# Altium project Rovot v4.PrjPcb
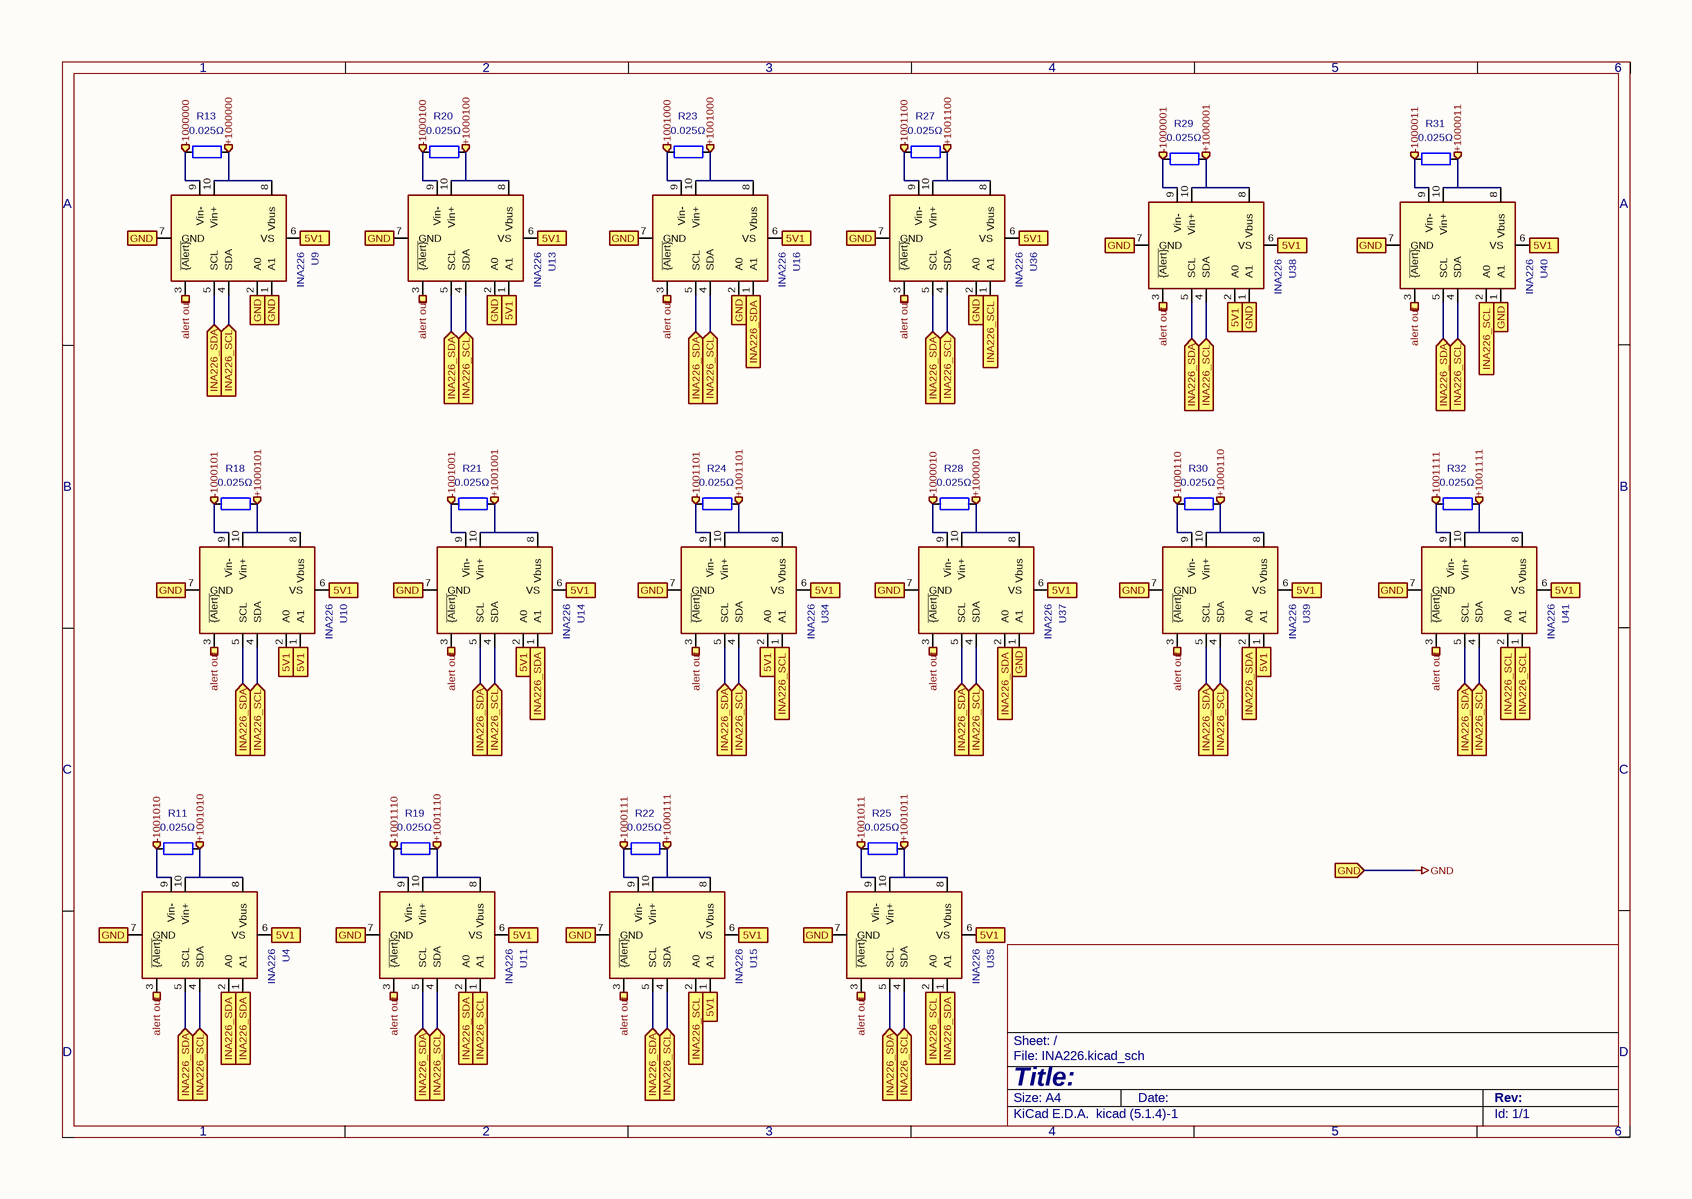
[diagram p0: INA226.SchDoc]
2 sheets, 32 parts. Net scope: flat (ports and power ports of the same name join across sheets).
Sheets:
  INA226.SchDoc
  root.SchDoc

## Sheet INA226.SchDoc
size 297 x 209 mm; SheetNumber: 2; SheetTotal: 2

### Parts
R11  0.025Ω  [R_1020_2550Metric]
R13  0.025Ω  [R_1020_2550Metric]
R18  0.025Ω  [R_1020_2550Metric]
R19  0.025Ω  [R_1020_2550Metric]
R20  0.025Ω  [R_1020_2550Metric]
R21  0.025Ω  [R_1020_2550Metric]
R22  0.025Ω  [R_1020_2550Metric]
R23  0.025Ω  [R_1020_2550Metric]
R24  0.025Ω  [R_1020_2550Metric]
R25  0.025Ω  [R_1020_2550Metric]
R27  0.025Ω  [R_1020_2550Metric]
R28  0.025Ω  [R_1020_2550Metric]
R29  0.025Ω  [R_1020_2550Metric]
R30  0.025Ω  [R_1020_2550Metric]
R31  0.025Ω  [R_1020_2550Metric]
R32  0.025Ω  [R_1020_2550Metric]
U4  INA226  [VSSOP-10_3x3mm_P0.5mm]
U9  INA226  [VSSOP-10_3x3mm_P0.5mm]
U10  INA226  [VSSOP-10_3x3mm_P0.5mm]
U11  INA226  [VSSOP-10_3x3mm_P0.5mm]
U13  INA226  [VSSOP-10_3x3mm_P0.5mm]
U14  INA226  [VSSOP-10_3x3mm_P0.5mm]
U15  INA226  [VSSOP-10_3x3mm_P0.5mm]
U16  INA226  [VSSOP-10_3x3mm_P0.5mm]
U34  INA226  [VSSOP-10_3x3mm_P0.5mm]
U35  INA226  [VSSOP-10_3x3mm_P0.5mm]
U36  INA226  [VSSOP-10_3x3mm_P0.5mm]
U37  INA226  [VSSOP-10_3x3mm_P0.5mm]
U38  INA226  [VSSOP-10_3x3mm_P0.5mm]
U39  INA226  [VSSOP-10_3x3mm_P0.5mm]
U40  INA226  [VSSOP-10_3x3mm_P0.5mm]
U41  INA226  [VSSOP-10_3x3mm_P0.5mm]

### Ports
5V1 (in), +1000000 (in), +1000001 (in), +1000010 (in), +1000011 (in), +1000100 (in), +1000101 (in), +1000110 (in), +1000111 (in), +1001000 (in), +1001001 (in), +1001010 (in), +1001011 (in), +1001100 (in), +1001101 (in), +1001110 (in), +1001111 (in), -1000000 (in), -1000001 (in), -1000010 (in), -1000011 (in), -1000100 (in), -1000101 (in), -1000110 (in), -1000111 (in), -1001000 (in), -1001001 (in), -1001010 (in), -1001011 (in), -1001100 (in), -1001101 (in), -1001110 (in), -1001111 (in), alert out (in), GND (in), INA226_SCL (in), INA226_SDA (in)

### Nets
GND: U4.7(GND) U9.1(A1) U9.2(A0) U9.7(GND) U10.7(GND) U11.7(GND) U13.2(A0) U13.7(GND) U14.7(GND) U15.7(GND) U16.2(A0) U16.7(GND) U34.7(GND) U35.7(GND) U36.2(A0) U36.7(GND) U37.1(A1) U37.7(GND) U38.1(A1) U38.7(GND) U39.7(GND) U40.1(A1) U40.7(GND) U41.7(GND) ; port GND
NetR11_1: R11.1 U4.8(Vbus) U4.10(Vin+) ; port +1001010
NetR11_2: R11.2 U4.9(Vin-) ; port -1001010
NetR13_1: R13.1 U9.8(Vbus) U9.10(Vin+) ; port +1000000
NetR13_2: R13.2 U9.9(Vin-) ; port -1000000
NetR18_1: R18.1 U10.8(Vbus) U10.10(Vin+) ; port +1000101
NetR18_2: R18.2 U10.9(Vin-) ; port -1000101
NetR19_1: R19.1 U11.8(Vbus) U11.10(Vin+) ; port +1001110
NetR19_2: R19.2 U11.9(Vin-) ; port -1001110
NetR20_1: R20.1 U13.8(Vbus) U13.10(Vin+) ; port +1000100
NetR20_2: R20.2 U13.9(Vin-) ; port -1000100
NetR21_1: R21.1 U14.8(Vbus) U14.10(Vin+) ; port +1001001
NetR21_2: R21.2 U14.9(Vin-) ; port -1001001
NetR22_1: R22.1 U15.8(Vbus) U15.10(Vin+) ; port +1000111
NetR22_2: R22.2 U15.9(Vin-) ; port -1000111
NetR23_1: R23.1 U16.8(Vbus) U16.10(Vin+) ; port +1001000
NetR23_2: R23.2 U16.9(Vin-) ; port -1001000
NetR24_1: R24.1 U34.8(Vbus) U34.10(Vin+) ; port +1001101
NetR24_2: R24.2 U34.9(Vin-) ; port -1001101
NetR25_1: R25.1 U35.8(Vbus) U35.10(Vin+) ; port +1001011
NetR25_2: R25.2 U35.9(Vin-) ; port -1001011
NetR27_1: R27.1 U36.8(Vbus) U36.10(Vin+) ; port +1001100
NetR27_2: R27.2 U36.9(Vin-) ; port -1001100
NetR28_1: R28.1 U37.8(Vbus) U37.10(Vin+) ; port +1000010
NetR28_2: R28.2 U37.9(Vin-) ; port -1000010
NetR29_1: R29.1 U38.8(Vbus) U38.10(Vin+) ; port +1000001
NetR29_2: R29.2 U38.9(Vin-) ; port -1000001
NetR30_1: R30.1 U39.8(Vbus) U39.10(Vin+) ; port +1000110
NetR30_2: R30.2 U39.9(Vin-) ; port -1000110
NetR31_1: R31.1 U40.8(Vbus) U40.10(Vin+) ; port +1000011
NetR31_2: R31.2 U40.9(Vin-) ; port -1000011
NetR32_1: R32.1 U41.8(Vbus) U41.10(Vin+) ; port +1001111
NetR32_2: R32.2 U41.9(Vin-) ; port -1001111
NetU4_1: U4.1(A1) U4.2(A0) U4.5(SCL) U9.5(SCL) U10.5(SCL) U11.2(A0) U11.5(SCL) U13.5(SCL) U14.1(A1) U14.5(SCL) U15.5(SCL) U16.1(A1) U16.5(SCL) U34.5(SCL) U35.1(A1) U35.5(SCL) U36.5(SCL) U37.2(A0) U37.5(SCL) U38.5(SCL) U39.2(A0) U39.5(SCL) U40.5(SCL) U41.5(SCL) ; port INA226_SDA
NetU4_3: U4.3(~{{Alert}}) U9.3(~{{Alert}}) U10.3(~{{Alert}}) U11.3(~{{Alert}}) U13.3(~{{Alert}}) U14.3(~{{Alert}}) U15.3(~{{Alert}}) U16.3(~{{Alert}}) U34.3(~{{Alert}}) U35.3(~{{Alert}}) U36.3(~{{Alert}}) U37.3(~{{Alert}}) U38.3(~{{Alert}}) U39.3(~{{Alert}}) U40.3(~{{Alert}}) U41.3(~{{Alert}}) ; port alert out
NetU4_4: U4.4(SDA) U9.4(SDA) U10.4(SDA) U11.1(A1) U11.4(SDA) U13.4(SDA) U14.4(SDA) U15.2(A0) U15.4(SDA) U16.4(SDA) U34.1(A1) U34.4(SDA) U35.2(A0) U35.4(SDA) U36.1(A1) U36.4(SDA) U37.4(SDA) U38.4(SDA) U39.4(SDA) U40.2(A0) U40.4(SDA) U41.1(A1) U41.2(A0) U41.4(SDA) ; port INA226_SCL
NetU4_6: U4.6(VS) U9.6(VS) U10.1(A1) U10.2(A0) U10.6(VS) U11.6(VS) U13.1(A1) U13.6(VS) U14.2(A0) U14.6(VS) U15.1(A1) U15.6(VS) U16.6(VS) U34.2(A0) U34.6(VS) U35.6(VS) U36.6(VS) U37.6(VS) U38.2(A0) U38.6(VS) U39.1(A1) U39.6(VS) U40.6(VS) U41.6(VS) ; port 5V1

### Notes on the sheet
- 1
- 2
- 3
- 4
- 5
- 6
- A
- B
- C
- D
- Title:
- File: INA226.kicad_sch
- Sheet: /
- KiCad E.D.A.  kicad (5.1.4)-1
- Size: A4
- Date:
- Rev:
- Id: 1/1

### Library data of the parts
R11 R13 R18-R25 R27-R32 = R: Url: https://hu.farnell.com/vishay/wfma2512r0250fea/res-0r025-3w-2512-metal-plate/dp/3102734?srsltid=AfmBOoo6H5Un0cHiqeag9ovCQvXpnbJqYON7v56Iowkpb5I1FAlzBtap; Value: 0.025Ω; Footprint: Resistor_SMD:R_1020_2550Metric
U4 U9-U11 U13-U16 U34-U41 = INA226: Value: INA226; Footprint: Package_SO:VSSOP-10_3x3mm_P0.5mm

## Sheet root.SchDoc
size A4; SheetNumber: 1; SheetTotal: 1